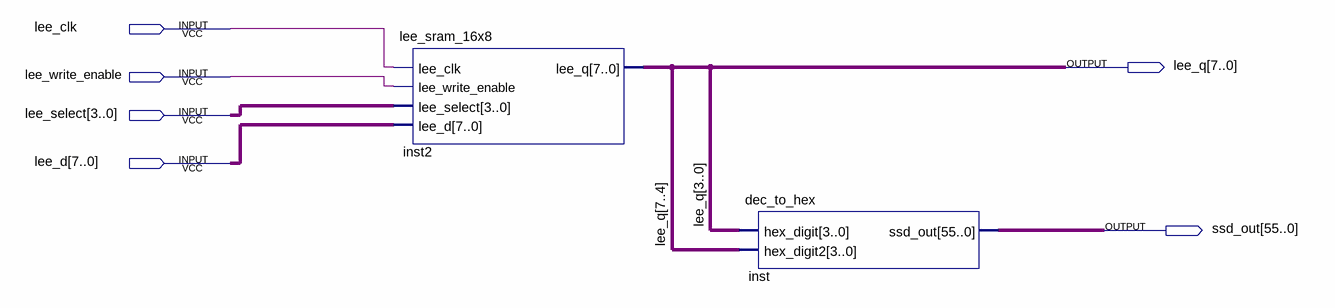
[diagram p0: schematic sheet]
// Quartus schematic sram16x8ssd.bdf as structural Verilog: 2 symbols, 6 pins
module sram16x8ssd (
  input  lee_clk,
  input  lee_write_enable,
  input  [3:0] lee_select,
  input  [7:0] lee_d,
  output [7:0] lee_q,
  output [55:0] ssd_out
);

  lee_sram_16x8 inst2 (
    .lee_clk(lee_clk), .lee_write_enable(lee_write_enable), .lee_select(lee_select), .lee_d(lee_d),
    .lee_q(lee_q));
  dec_to_hex inst (.hex_digit(lee_q[3:0]), .hex_digit2(lee_q[7:4]), .ssd_out(ssd_out));
endmodule
